# Altium schematic sheet MCU.SchDoc
size 177 x 114 mm; SheetNumber: 1; SheetTotal: 1
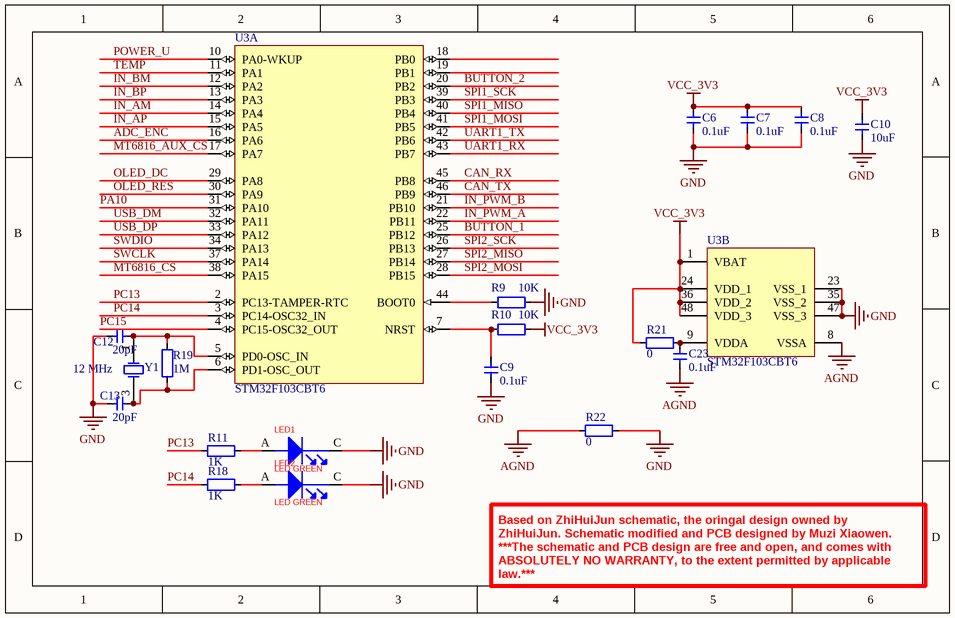
[diagram p0: MCU.SchDoc]

## Parts
C6  0.1uF  [CAP_0402]
C7  0.1uF  [CAP_0402]
C8  0.1uF  [CAP_0402]
C9  0.1uF  [CAP_0402]
C10  10uF  [CAP_0402]
C12  20pF  [CAP_0402]
C13  20pF  [CAP_0402]
C23  0.1uF  [CAP_0402]
LED1  LED GREEN  [LED-0603]
LED2  LED GREEN  [LED-0603]
R9  10K  [RES_0402]
R10  10K  [RES_0402]
R11  1K  [RES_0402]
R18  1K  [RES_0402]
R19  1M  [RES_0402]
R21  0  [RES_0402]
R22  0  [RES_0402]
U3  STM32F103CBT6  [LQFP-48]  (parts A,B of 2)
Y1  value 12 MHz  [LC-SMD-3225_4P]  (hidden comment: XTAL-4)

## Nets
AGND: C23.1 R22.2 U3.8(VSSA)
GND: C6.1 C7.1 C8.1 C9.1 C10.1 C12.2 C13.2 LED1.C(CATHODE) LED2.C(CATHODE) R9.2 R22.1 U3.23(VSS_1) U3.35(VSS_2) U3.47(VSS_3)
VCC_3V3: C6.2 C7.2 C8.2 C10.2 R10.2 R21.2 U3.1(VBAT) U3.24(VDD_1) U3.36(VDD_2) U3.48(VDD_3)
ADC_ENC: U3.16(PA6)
BUTTON_1: U3.25(PB12)
BUTTON_2: U3.20(PB2)
CAN_RX: U3.45(PB8)
CAN_TX: U3.46(PB9)
IN_AM: U3.14(PA4)
IN_AP: U3.15(PA5)
IN_BM: U3.12(PA2)
IN_BP: U3.13(PA3)
IN_PWM_A: U3.22(PB11)
IN_PWM_B: U3.21(PB10)
MT6816_AUX_CS: U3.17(PA7)
MT6816_CS: U3.38(PA15)
OLED_DC: U3.29(PA8)
OLED_RES: U3.30(PA9)
PA10: U3.31(PA10)
PC13: R11.1 U3.2(PC13-TAMPER-RTC)
PC14: R18.1 U3.3(PC14-OSC32_IN)
PC15: U3.4(PC15-OSC32_OUT)
POWER_U: U3.10(PA0-WKUP)
SPI1_MISO: U3.40(PB4)
SPI1_MOSI: U3.41(PB5)
SPI1_SCK: U3.39(PB3)
SPI2_MISO: U3.27(PB14)
SPI2_MOSI: U3.28(PB15)
SPI2_SCK: U3.26(PB13)
SWCLK: U3.37(PA14)
SWDIO: U3.34(PA13)
TEMP: U3.11(PA1)
UART1_RX: U3.43(PB7)
UART1_TX: U3.42(PB6)
USB_DM: U3.32(PA11)
USB_DP: U3.33(PA12)
NetC9_2: C9.2 R10.1 U3.7(NRST)
NetC12_1: C12.1 R19.2 U3.5(PD0-OSC_IN) Y1.1(OSC1)
NetC13_1: C13.1 R19.1 U3.6(PD1-OSC_OUT) Y1.3(OSC2)
NetC23_2: C23.2 R21.1 U3.9(VDDA)
NetLED1_A: LED1.A(ANODE) R11.2
NetLED2_A: LED2.A(ANODE) R18.2
NetR9_1: R9.1 U3.44(BOOT0)

Not connected (* = marked no-connect by the designer): U3 18(PB0) 19(PB1)

## Notes on the sheet
- Based on ZhiHuiJun schematic, the oringal design owned by ZhiHuiJun. Schematic modified and PCB designed by Muzi Xiaowen. ***The schematic and PCB design are free and open, and comes with ABSOLUTELY NO WARRANTY, to the extent permitted by applicable law.***

## Library data of the parts
C6-C10 C23 = 电容-0402: Capacitor; Value: 0.1u
C12 C13 = 电容-0402: Capacitor; Value: 20pF
LED1 LED2 = LED: LED GRN SGL RA 25mA 4.1V SMD; CLASS: IC; CAD_APPROVED: Yes; MFG_PN01: AA4040ZGS; MFG_NAME01: Kingbright; AGILE_PN: 370-76642; PN: 19-217/G7C-AN1P2/3T; HEIGHT: 4.25MM; ROHS: Yes
R9-R11 R18 R19 = 电阻-0402: Resistor; Value: 22R
R21 R22 = 电阻-0402: Resistor; Value: 0R
U3 = STM32F103CBT6: ARM Cortex-M3 32-bit MCU, 128 KB Flash, 20 KB Internal RAM, 37 I/Os, 48-pin LQFP, -40 to 85 degC, Tray; A/D Converter: 2x12-bit (10 Channel); FLASH Size (Prog) (kB): 128; I/Os (High Current): 37; Internal RAM Size (kB): 20; Operating Frequency(F) (Processor speed) (MHz): 72; Supply Voltage(Vcc) min (V): 2; DatasheetVersion: Rev. 16; PackageVersion: Rev. 6, 06/2013; PackageReference: LQFP48; PackageDescription: 48-Pin Low Profile Quad Flat Package, 7 x 7 mm Body, 0.5 mm Pitch; Supplier 1: Digi-Key; Supplier Part Number 1: 497-6288-ND; Supplier 2: Farnell; Supplier Part Number 2: 1606327; Supplier 3: Newark; Supplier Part Number 3: 11N8296; Supplier 4: Newark; Supplier Part Number 4: 57P1214; Supplier 5: Mouser; Supplier Part Number 5: 511-STM32F103CBT6; Core: ARM Cortex-M3; Packing: Tray; Mounting Technology: Surface Mount; PartNumber: STM32F103CBT6; ComponentLink1Description: Manufacturer URL; ComponentLink1URL: http://www.st.com/web/en/home.html; ComponentLink2Description: Datasheet; ComponentLink2URL: http://www.st.com/st-web-ui/static/active/en/resource/technical/document/datasheet/CD00161566.pdf; ComponentLink3Description: Package Specification; ComponentLink3URL: http://www.st.com/st-web-ui/static/active/en/resource/technical/document/datasheet/DM00058181.pdf
Y1 = XTAL-4: Crystal; Parameters: 20ppm 20pF -20/+70C; Manufacturer: *; Distributors: Comet; Price: 0.238